# Altium schematic sheet emaker1_P1.schdoc
size 622 x 266 mm; Symbol: Sheet-Symbol_A4; Device: Sheet-Symbol_A4; Company: 嘉立创EDA; Version: V1.0; Page Size: A4; @Project Name: SINK-DEMO; @Page Count: 1; @Update Date: 2024-11-22; @Create Date: 2024-11-21; @Schematic Name: emaker; @Page No: 1; @Page Name: P1; Title Block Position: 3; Width: 2400; Height: 1000; Region Start: 1; X Region Count: 6; Y Region Count: 4; Blade Width: 10; @Board Name: emaker; @Create Time: 15:43:03; @Update Time: 09:23:04
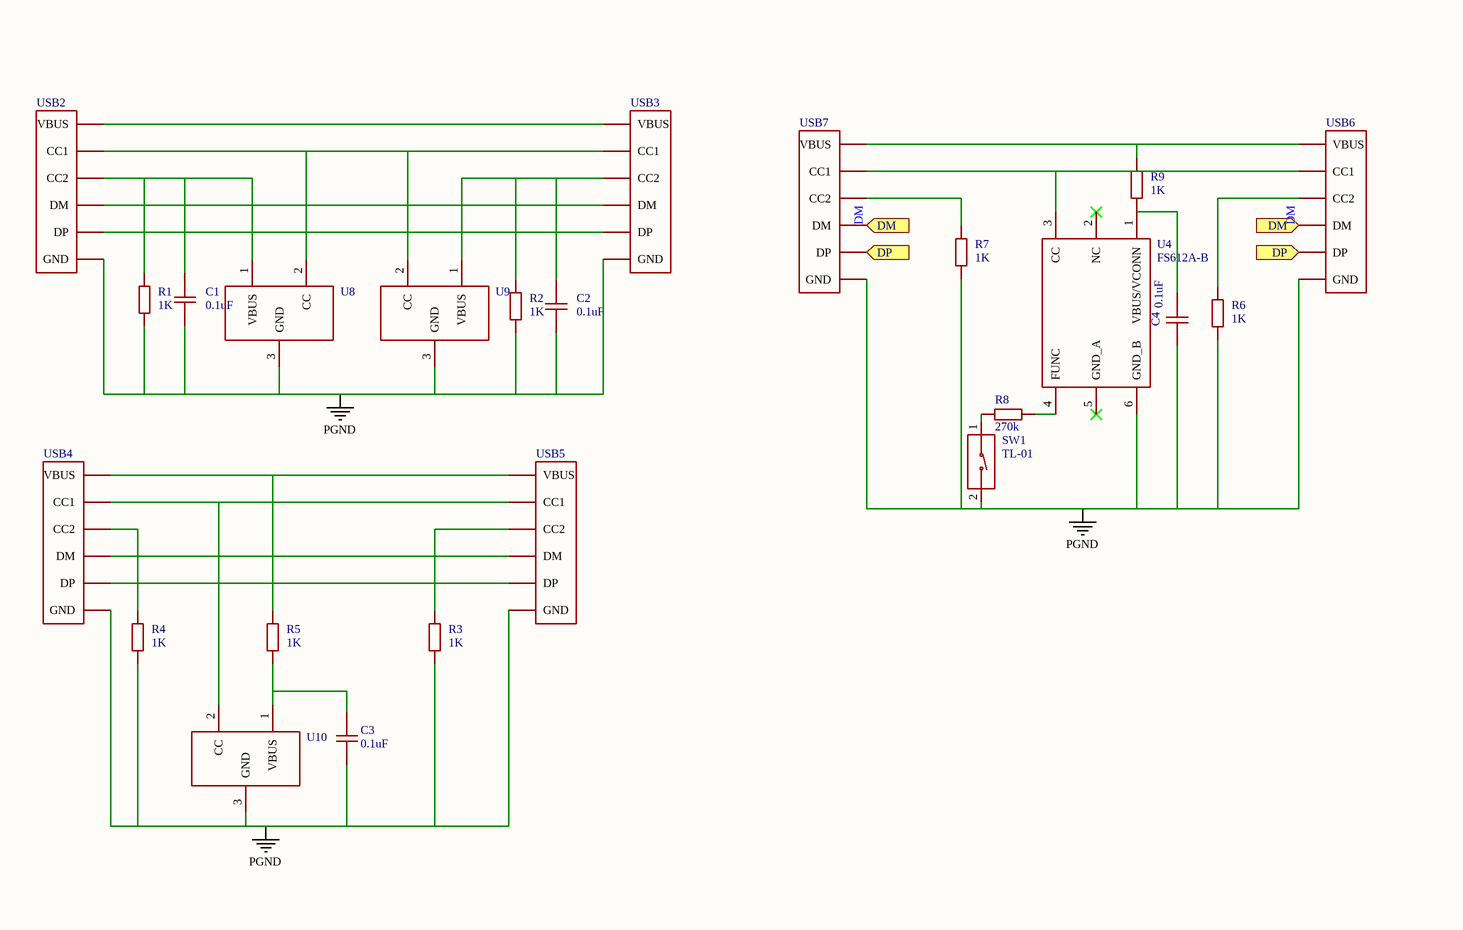
[diagram p0: emaker1_P1.schdoc, left]
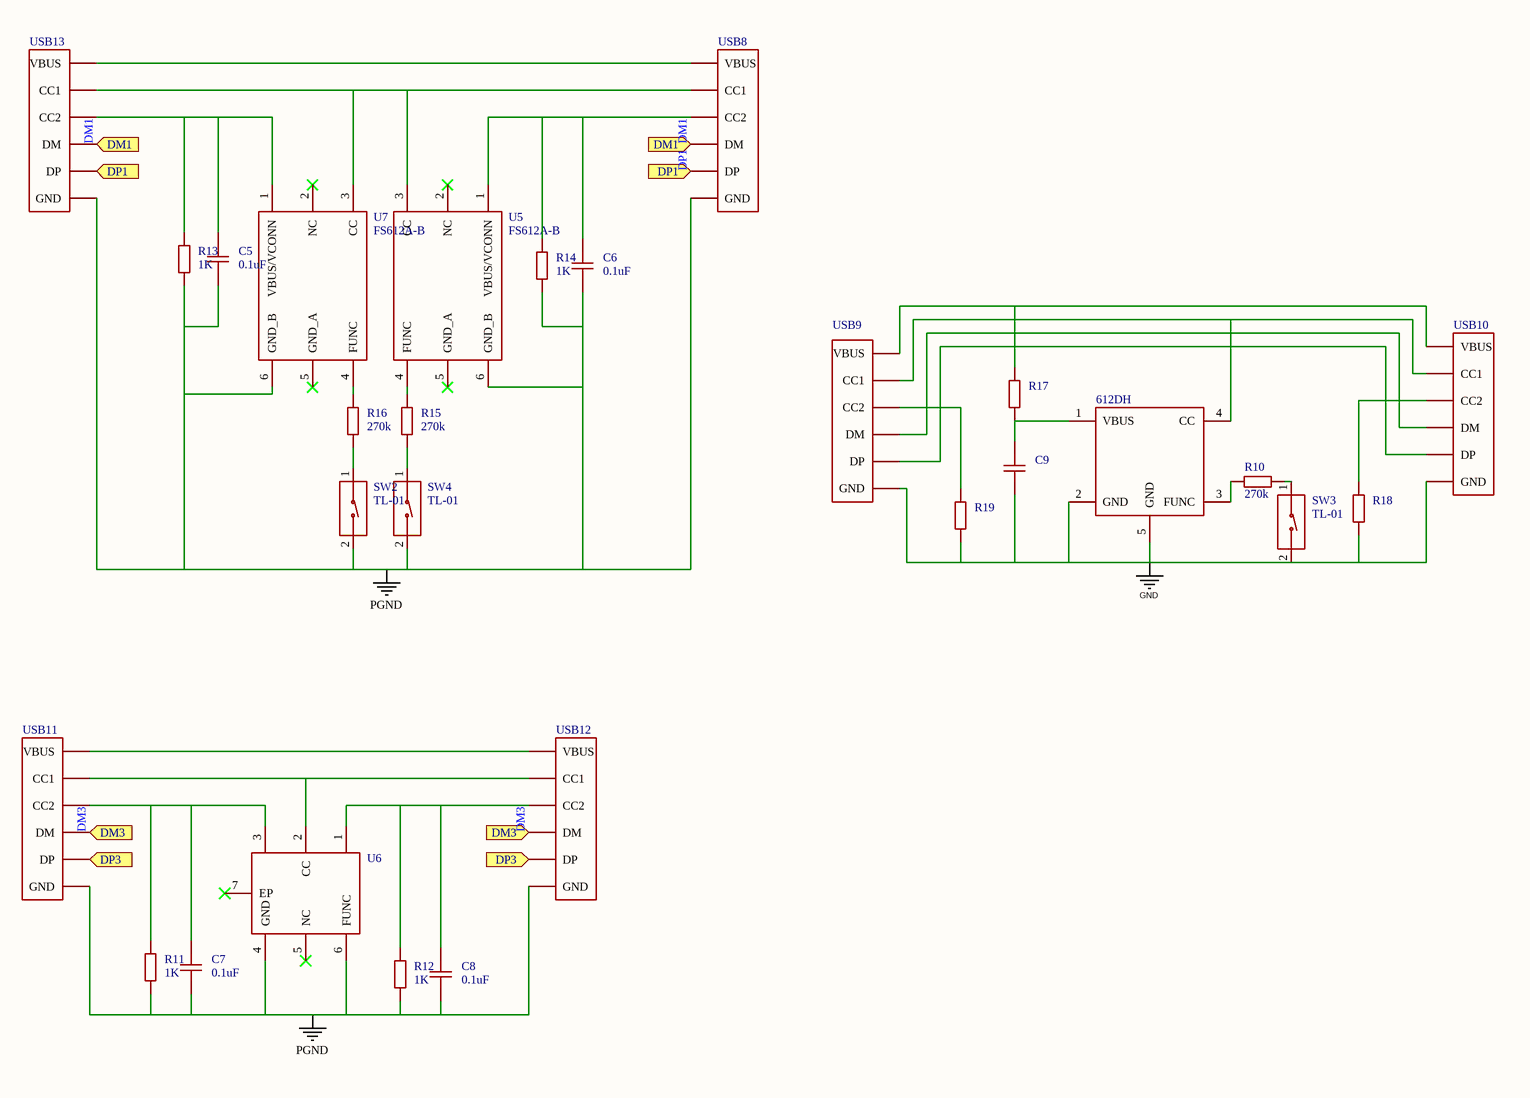
[diagram p1: emaker1_P1.schdoc, right]

## Parts
612DH  FS612D  [DFN-1*1-4]  (value not drawn)
C1  0.1uF  [C0603]  (value not drawn)
C2  0.1uF  [C0603]  (value not drawn)
C3  0.1uF  [C0603]  (value not drawn)
C4  0.1uF  [C0603]  (value not drawn)
C5  0.1uF  [C0603]  (value not drawn)
C6  0.1uF  [C0603]  (value not drawn)
C7  0.1uF  [C0603]  (value not drawn)
C8  0.1uF  [C0603]  (value not drawn)
C9  1uF  [0402C-1]  (value not drawn)
R1  1K  [R0603]  (value not drawn)
R2  1K  [R0603]  (value not drawn)
R3  1K  [R0603]  (value not drawn)
R4  1K  [R0603]  (value not drawn)
R5  1K  [R0603]  (value not drawn)
R6  1K  [R0603]  (value not drawn)
R7  1K  [R0603]  (value not drawn)
R8  270k  [R0603]  (value not drawn)
R9  1K  [R0603]  (value not drawn)
R10  270k  [R0603]  (value not drawn)
R11  1K  [R0603]  (value not drawn)
R12  1K  [R0603]  (value not drawn)
R13  1K  [R0603]  (value not drawn)
R14  1K  [R0603]  (value not drawn)
R15  270k  [R0603]  (value not drawn)
R16  270k  [R0603]  (value not drawn)
R17  1K  [0402R]  (value not drawn)
R18  1K  [0402R]  (value not drawn)
R19  1K  [0402R]  (value not drawn)
SW1  TL-01  [SW-TH_TL-01]  (value not drawn)
SW2  TL-01  [SW-TH_TL-01]  (value not drawn)
SW3  TL-01  [SW-TH_TL-01]  (value not drawn)
SW4  TL-01  [SW-TH_TL-01]  (value not drawn)
U4  FS612A-B  [SOT-23-6]
U5  FS612A-B  [SOT-23-6]
U6  332H  [332H]  (value not drawn)
U7  FS612A-B  [SOT-23-6]
U8  fs611  [PG-SOT23-3_L2.9-W1.3-P1.90-LS2.4-BR]  (value not drawn)
U9  fs611  [PG-SOT23-3_L2.9-W1.3-P1.90-LS2.4-BR]  (value not drawn)
U10  fs611  [PG-SOT23-3_L2.9-W1.3-P1.90-LS2.4-BR]  (value not drawn)
USB2  TYPEC-14PIN(公头）  [TYPE-C14P]  (value not drawn)
USB3  TYPEC-14PIN(公头）  [TYPE-C14P]  (value not drawn)
USB4  TYPEC-14PIN(公头）  [TYPE-C14P]  (value not drawn)
USB5  TYPEC-14PIN(公头）  [TYPE-C14P]  (value not drawn)
USB6  TYPEC-14PIN(公头）  [TYPE-C14P]  (value not drawn)
USB7  TYPEC-14PIN(公头）  [TYPE-C14P]  (value not drawn)
USB8  TYPEC-14PIN(公头）  [TYPE-C14P]  (value not drawn)
USB9  TYPEC-14PIN(公头）  [TYPE-C14P]  (value not drawn)
USB10  TYPEC-14PIN(公头）  [TYPE-C14P]  (value not drawn)
USB11  TYPEC-14PIN(公头）  [TYPE-C14P]  (value not drawn)
USB12  TYPEC-14PIN(公头）  [TYPE-C14P]  (value not drawn)
USB13  TYPEC-14PIN(公头）  [TYPE-C14P]  (value not drawn)

## Ports
DM1 (in), DM3 (in), DM (in), DP1 (in), DP3 (in), DP (in)

## Nets
GND: 612DH.2(GND) 612DH.5(GND) C9.2 R18.1 R19.1 SW3.2 USB9.GND USB10.GND
PGND: C1.1 C2.1 C3.1 C4.1 C5.1 C6.1 C7.1 C8.1 R1.1 R2.1 R3.1 R4.1 R6.1 R7.1 R11.1 R12.1 R13.1 R14.1 SW1.2 SW2.2 SW4.2 U4.6(GND_B) U5.6(GND_B) U6.4(GND) U6.6(FUNC) U7.6(GND_B) U8.3(GND) U9.3(GND) U10.3(GND) USB2.GND USB3.GND USB4.GND USB5.GND USB6.GND USB7.GND USB8.GND USB11.GND USB12.GND USB13.GND
DM: USB6.DM USB7.DM ; port DM
DM1: USB8.DM USB13.DM ; port DM1
DM3: USB11.DM USB12.DM ; port DM3
DP: USB6.DP USB7.DP ; port DP
DP1: USB8.DP USB13.DP ; port DP1
DP3: USB11.DP USB12.DP ; port DP3
Net612DH_1: 612DH.1(VBUS) C9.1 R17.1
Net612DH_3: 612DH.3(FUNC) R10.2
Net612DH_4: 612DH.4(CC) USB9.CC1 USB10.CC1
NetC1_2: C1.2 R1.2 U8.1(VBUS) USB2.CC2
NetC2_2: C2.2 R2.2 U9.1(VBUS) USB3.CC2
NetC3_2: C3.2 R5.1 U10.1(VBUS)
NetC4_2: C4.2 R9.1 U4.1(VBUS/VCONN)
NetC5_2: C5.2 R13.2 U7.1(VBUS/VCONN) USB13.CC2
NetC6_2: C6.2 R14.2 U5.1(VBUS/VCONN) USB8.CC2
NetC7_2: C7.2 R11.2 U6.3 USB11.CC2
NetC8_2: C8.2 R12.2 U6.1 USB12.CC2
NetR3_2: R3.2 USB5.CC2
NetR4_2: R4.2 USB4.CC2
NetR5_2: R5.2 USB4.VBUS USB5.VBUS
NetR6_2: R6.2 USB6.CC2
NetR7_2: R7.2 USB7.CC2
NetR8_1: R8.1 SW1.1
NetR8_2: R8.2 U4.4(FUNC)
NetR9_2: R9.2 USB6.VBUS USB7.VBUS
NetR10_1: R10.1 SW3.1
NetR15_1: R15.1 SW4.1
NetR15_2: R15.2 U5.4(FUNC)
NetR16_1: R16.1 SW2.1
NetR16_2: R16.2 U7.4(FUNC)
NetR17_2: R17.2 USB9.VBUS USB10.VBUS
NetR18_2: R18.2 USB10.CC2
NetR19_2: R19.2 USB9.CC2
NetU4_3: U4.3(CC) USB6.CC1 USB7.CC1
NetU5_3: U5.3(CC) U7.3(CC) USB8.CC1 USB13.CC1
NetU6_2: U6.2(CC) USB11.CC1 USB12.CC1
NetU8_2: U8.2(CC) U9.2(CC) USB2.CC1 USB3.CC1
NetU10_2: U10.2(CC) USB4.CC1 USB5.CC1
NetUSB2_DM: USB2.DM USB3.DM
NetUSB2_DP: USB2.DP USB3.DP
NetUSB2_VBUS: USB2.VBUS USB3.VBUS
NetUSB4_DM: USB4.DM USB5.DM
NetUSB4_DP: USB4.DP USB5.DP
NetUSB8_VBUS: USB8.VBUS USB13.VBUS
NetUSB9_DM: USB9.DM USB10.DM
NetUSB9_DP: USB9.DP USB10.DP
NetUSB11_VBUS: USB11.VBUS USB12.VBUS

Not connected (* = marked no-connect by the designer): U4 2(NC)* 5(GND_A)*; U5 2(NC)* 5(GND_A)*; U6 5(NC)* 7(EP)*; U7 2(NC)* 5(GND_A)*

## Notes on the sheet
- 1
- 2
- 3
- 4
- 5
- 6
- A
- B
- C
- 原理图
- emaker
- 创建日期
- 更新日期
- 2024-11-22
- 2024-11-21
- D
- 审阅
- 绘制
- 图页
- P1
- 物料编码
- SINK-DEMO
- 版本
- 尺寸
- 页
- 共
- V1.0
- A4
- 嘉立创EDA

## Library data of the parts
612DH = FS612D: Add into BOM: yes; Symbol: FS612D; Device: FS612D; Convert to PCB: yes
C1-C8 = CAP_0603: Symbol: CapAcitance; Convert to PCB: yes; Value: 100nF; Device: CAP_0603; Add into BOM: yes; Supplier Footprint: 0603
C9 = 1uF: Symbol: 0603C; Add into BOM: yes; Value: 100nF; Device: 1uF; Convert to PCB: yes
R1-R16 = Res_0603: Symbol: 电阻; Convert to PCB: yes; Value: 10K; Device: Res_0603; Add into BOM: yes; Supplier Footprint: 0603
R17-R19 = 10K: Add into BOM: yes; Symbol: 10K; Device: 10K; Value: 1K; Convert to PCB: yes
SW1-SW4 = TL-01: Manufacturer: Yuandi(元迪); Add into BOM: yes; Symbol: TL-01; Device: TL-01; LCSC Part Name: 拨码开关插件黑色01P-1PIN间距2.54mm立式直插正拨平拨1位DIP; Supplier Part: C703787; Manufacturer Part: TL-01; Supplier Footprint: 插件; JLCPCB Part Class: 扩展库; Datasheet: https://atta.szlcsc.com/upload/public/pdf/source/20200720/C703787_2E451B760729F3FFBC0D95C9F91E9AFC.pdf; Supplier: LCSC; Convert to PCB: yes
U4 U5 U7 = FS612A-B: Add into BOM: yes; Symbol: FS612A-B; Device: FS612A-B; Convert to PCB: yes
U6 = 332H: Add into BOM: yes; Symbol: 332H; Device: 332H; Convert to PCB: yes
U8-U10 = fs611: Add into BOM: yes; Symbol: fs611; Device: fs611; Convert to PCB: yes
USB2-USB13 = TYPEC-14PIN(公头）: Add into BOM: yes; Symbol: TYPEC-14PIN(公头）; Device: TYPEC-14PIN(公头）; Convert to PCB: yes